# Altium schematic sheet BreadBoardedCircuitSchematic.SchDoc
size Letter; DrawnBy: Jacob Grunwald; DocumentName: Breadboarded Circuit Schematic
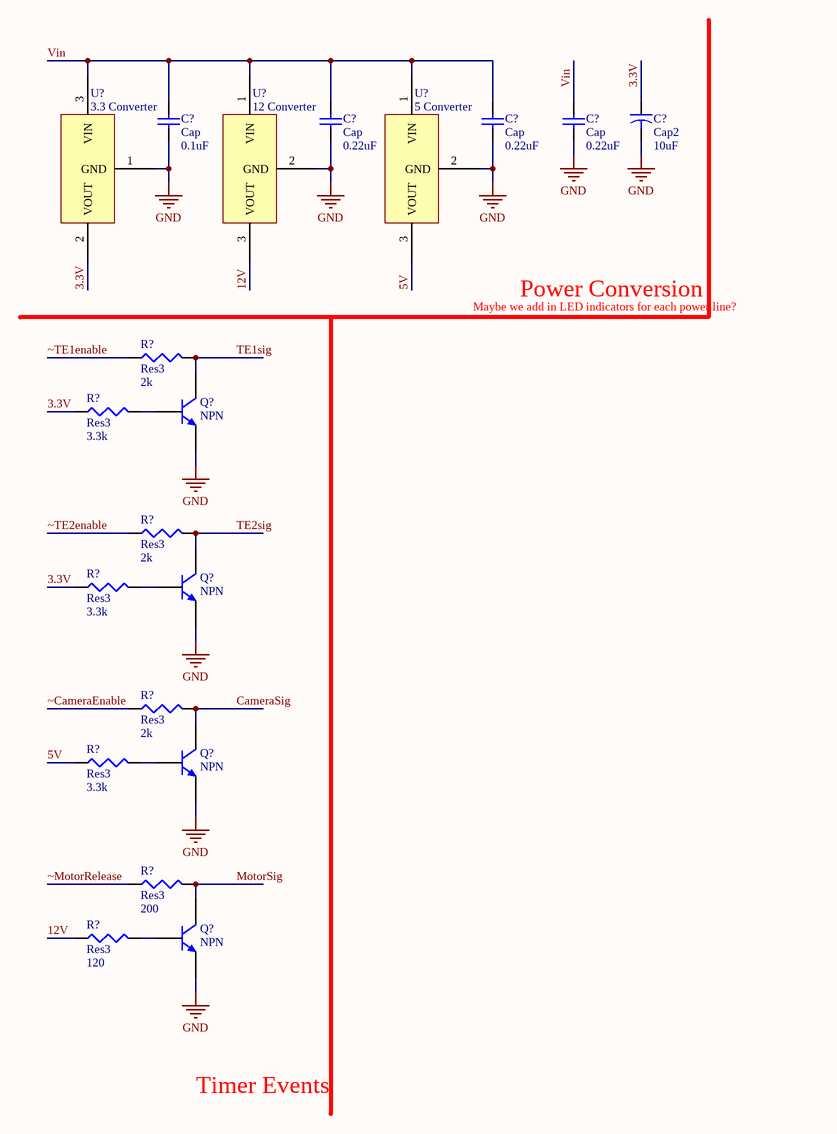
[diagram p0: BreadBoardedCircuitSchematic.SchDoc]

## Parts
(Parts that share a designator on the sheet are numbered #1, #2 ... from top to bottom, then left to right.)
C?#1  Cap2  value 10uF  [CAPR5-4X5]
C?#2  Cap  value 0.1uF  [RAD-0.3]
C?#3  Cap  value 0.22uF  [RAD-0.3]
C?#4  Cap  value 0.22uF  [RAD-0.3]
C?#5  Cap  value 0.22uF  [RAD-0.3]
Q?#1  NPN  [TO-226-AA]
Q?#2  NPN  [TO-226-AA]
Q?#3  NPN  [TO-226-AA]
Q?#4  NPN  [TO-226-AA]
R?#1  Res3  value 2k  [J1-0603]
R?#2  Res3  value 3.3k  [J1-0603]
R?#3  Res3  value 2k  [J1-0603]
R?#4  Res3  value 3.3k  [J1-0603]
R?#5  Res3  value 2k  [J1-0603]
R?#6  Res3  value 3.3k  [J1-0603]
R?#7  Res3  value 200  [J1-0603]
R?#8  Res3  value 120  [J1-0603]
U?#1  3.3 Converter  [Reg_IFX]
U?#2  12 Converter  [DPAK-3]
U?#3  5 Converter  [DPAK-3]

## Nets
GND: C?#1.2 C?#2.1 C?#3.1 C?#4.1 C?#5.1 Q?#1.3(E) Q?#2.3(E) Q?#3.3(E) Q?#4.3(E) U?#1.1(GND) U?#2.2(GND) U?#3.2(GND)
3.3V: C?#1.1 R?#2.1 R?#4.1 U?#1.2(VOUT)
5V: R?#6.1 U?#3.3(VOUT)
12V: R?#8.1 U?#2.3(VOUT)
CameraSig: Q?#3.1(C) R?#5.2
MotorSig: Q?#4.1(C) R?#7.2
TE1sig: Q?#1.1(C) R?#1.2
TE2sig: Q?#2.1(C) R?#3.2
Vin: C?#2.2 C?#3.2 C?#4.2 C?#5.2 U?#1.3(VIN) U?#2.1(VIN) U?#3.1(VIN)
~CameraEnable: R?#5.1
~MotorRelease: R?#7.1
~TE1enable: R?#1.1
~TE2enable: R?#3.1
NetQ?#1_2: Q?#1.2(B) R?#2.2
NetQ?#2_2: Q?#2.2(B) R?#4.2
NetQ?#3_2: Q?#3.2(B) R?#6.2
NetQ?#4_2: Q?#4.2(B) R?#8.2

## Notes on the sheet
- Maybe we add in LED indicators for each power line?
- Power Conversion
- Timer Events

## Library data of the parts
C?#1 = Cap2: Capacitor; Published: 23-Sep-2002; PackageReference: CAPR5-4X5; Publisher: Altium Limited; PackageDescription: Capacitor; 2 Leads
C?#2-C?#5 = Cap: Capacitor; Published: 8-Jun-2000; LatestRevisionDate: 17-Jul-2002; LatestRevisionNote: Re-released for DXP Platform.; PackageReference: RAD-0.3; Publisher: Altium Limited; PackageDescription: Radial Cap, Thru-Hole; 2 Leads; 0.3 in Pin Spacing
Q?#1-Q?#4 = NPN: NPN Bipolar Transistor; Published: 8-Jun-2000; LatestRevisionDate: 17-Jul-2002; LatestRevisionNote: Re-released for DXP Platform.; PackageReference: TO-226-AA; Publisher: Altium Limited; PackageDescription: TO, Flat Index; 3 In-Line, Axial Leads; Body Dia. 4.8mm; Leads 0.55 x 0.51 mm (max); Code_JEDEC: TO-226-AA
R?#1-R?#8 = Res3: Resistor; Published: 8-Jun-2000; LatestRevisionDate: 29-May-2009; LatestRevisionNote: IPC-7351 Footprint Added.; PackageReference: J1-0603; Publisher: Altium Limited; PackageDescription: Chip Resistor
U?#1 = REG_IFX
U?#2 U?#3 = DPAK-3